# Altium schematic sheet Hammerhead - MAX11300 Breakout Connectors R1.1.SchDoc
size B; SheetNumber: 4
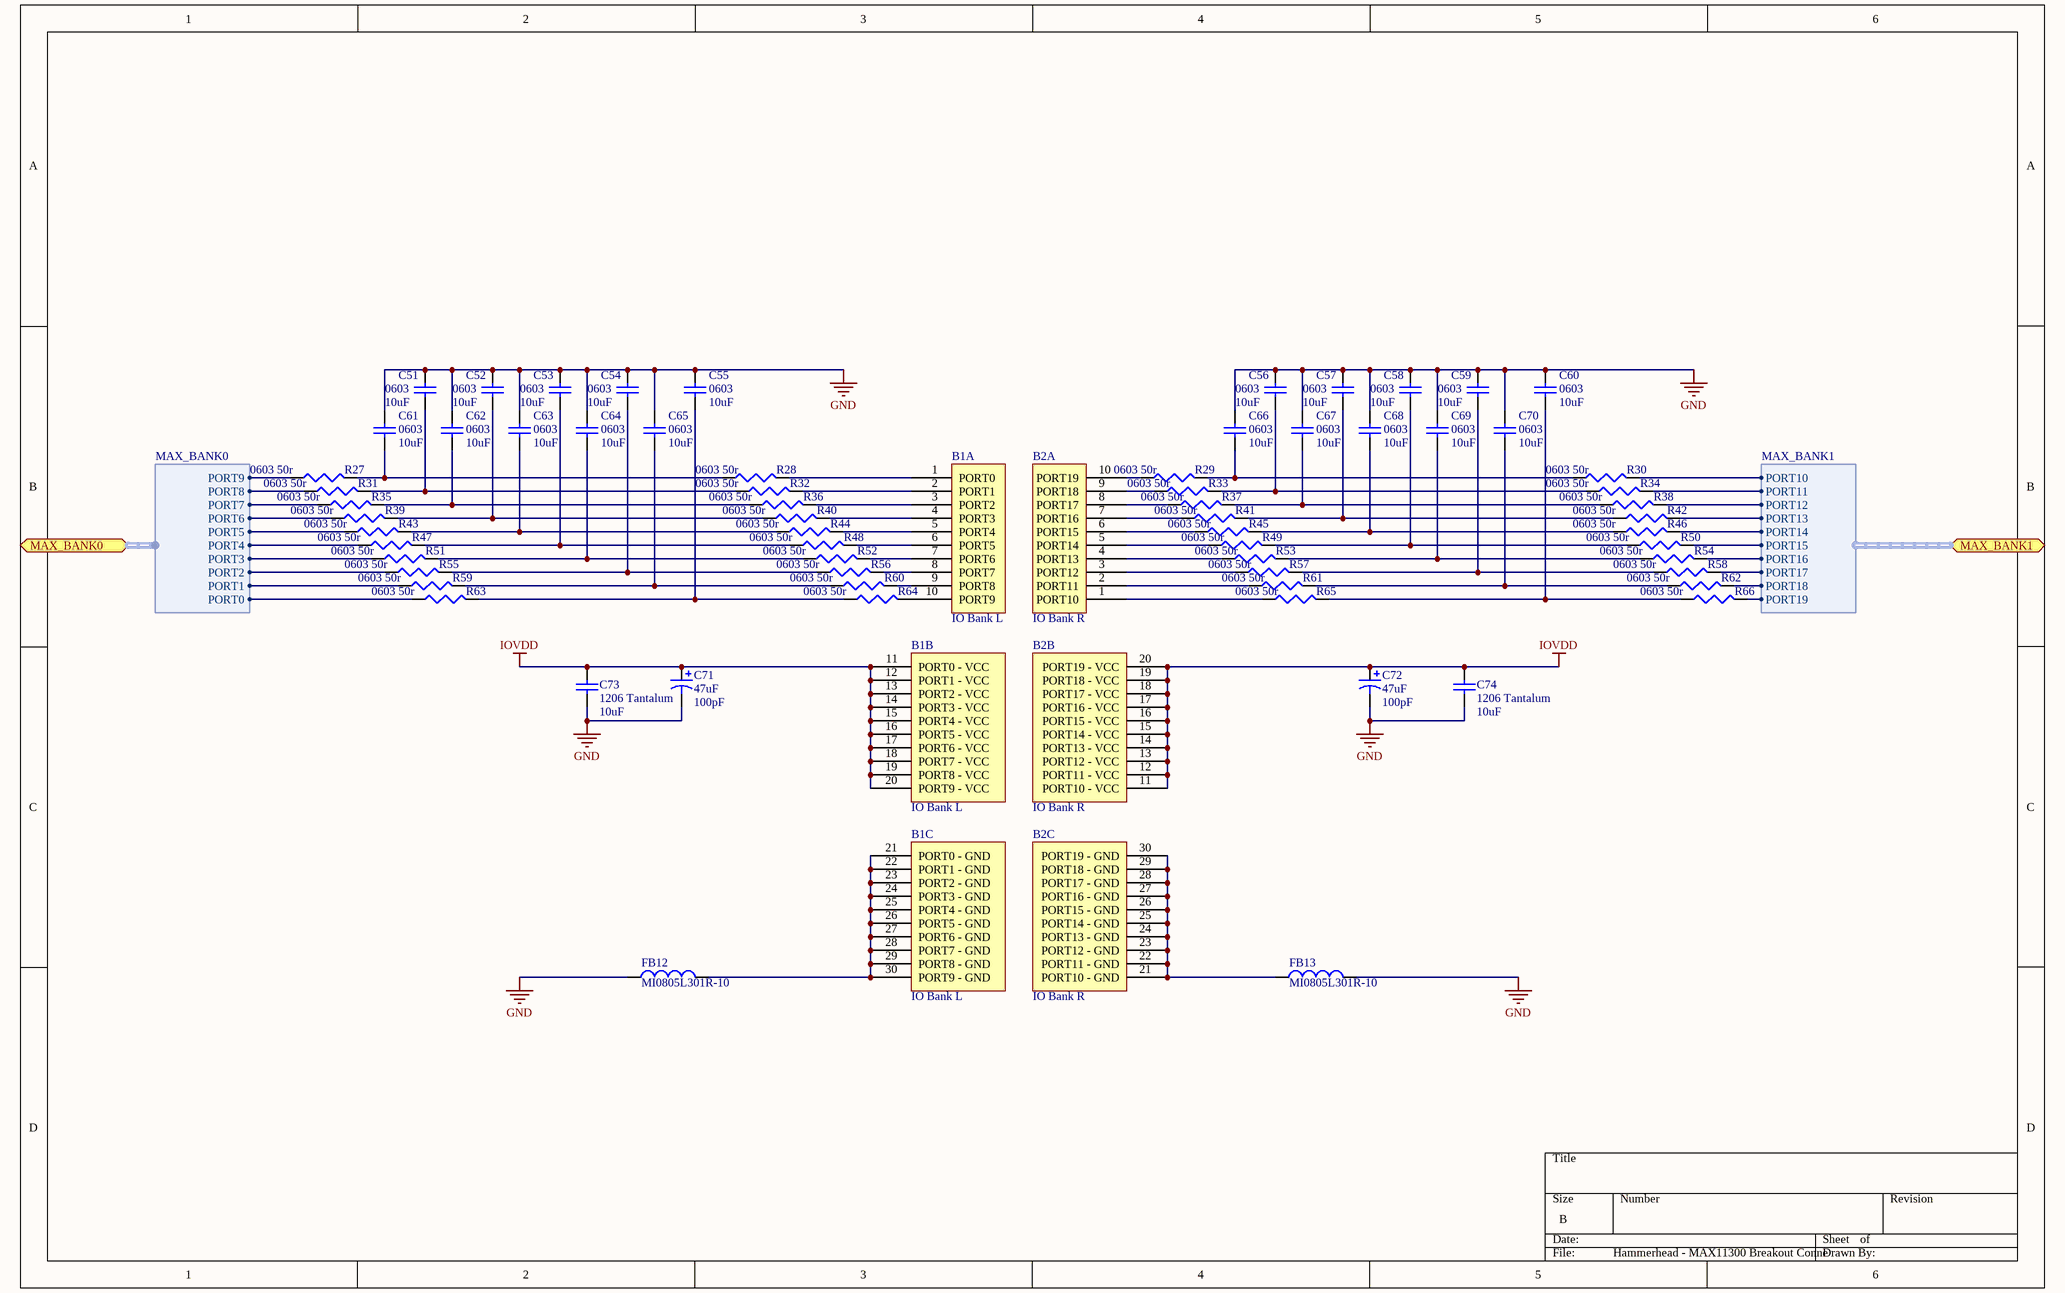
[diagram p0: Hammerhead - MAX11300 Breakout Connectors R1.1.SchDoc]

## Parts
B1  IO Bank L  [2.54mm 10X3 Header]  (parts A,B,C of 3)
B2  IO Bank R  [2.54mm 10X3 Header]  (parts A,B,C of 3)
C51  0603  value 10uF  [1608[0603]]
C52  0603  value 10uF  [1608[0603]]
C53  0603  value 10uF  [1608[0603]]
C54  0603  value 10uF  [1608[0603]]
C55  0603  value 10uF  [1608[0603]]
C56  0603  value 10uF  [1608[0603]]
C57  0603  value 10uF  [1608[0603]]
C58  0603  value 10uF  [1608[0603]]
C59  0603  value 10uF  [1608[0603]]
C60  0603  value 10uF  [1608[0603]]
C61  0603  value 10uF  [1608[0603]]
C62  0603  value 10uF  [1608[0603]]
C63  0603  value 10uF  [1608[0603]]
C64  0603  value 10uF  [1608[0603]]
C65  0603  value 10uF  [1608[0603]]
C66  0603  value 10uF  [1608[0603]]
C67  0603  value 10uF  [1608[0603]]
C68  0603  value 10uF  [1608[0603]]
C69  0603  value 10uF  [1608[0603]]
C70  0603  value 10uF  [1608[0603]]
C71  47uF  value 100pF  [Panasonic VS C]
C72  47uF  value 100pF  [Panasonic VS C]
C73  1206 Tantalum  value 10uF  [C1206]
C74  1206 Tantalum  value 10uF  [C1206]
FB12  MI0805L301R-10  [SM 0805 - gap trimmed]
FB13  MI0805L301R-10  [SM 0805 - gap trimmed]
R27  0603  value 50r  [J1-0603]
R28  0603  value 50r  [J1-0603]
R29  0603  value 50r  [J1-0603]
R30  0603  value 50r  [J1-0603]
R31  0603  value 50r  [J1-0603]
R32  0603  value 50r  [J1-0603]
R33  0603  value 50r  [J1-0603]
R34  0603  value 50r  [J1-0603]
R35  0603  value 50r  [J1-0603]
R36  0603  value 50r  [J1-0603]
R37  0603  value 50r  [J1-0603]
R38  0603  value 50r  [J1-0603]
R39  0603  value 50r  [J1-0603]
R40  0603  value 50r  [J1-0603]
R41  0603  value 50r  [J1-0603]
R42  0603  value 50r  [J1-0603]
R43  0603  value 50r  [J1-0603]
R44  0603  value 50r  [J1-0603]
R45  0603  value 50r  [J1-0603]
R46  0603  value 50r  [J1-0603]
R47  0603  value 50r  [J1-0603]
R48  0603  value 50r  [J1-0603]
R49  0603  value 50r  [J1-0603]
R50  0603  value 50r  [J1-0603]
R51  0603  value 50r  [J1-0603]
R52  0603  value 50r  [J1-0603]
R53  0603  value 50r  [J1-0603]
R54  0603  value 50r  [J1-0603]
R55  0603  value 50r  [J1-0603]
R56  0603  value 50r  [J1-0603]
R57  0603  value 50r  [J1-0603]
R58  0603  value 50r  [J1-0603]
R59  0603  value 50r  [J1-0603]
R60  0603  value 50r  [J1-0603]
R61  0603  value 50r  [J1-0603]
R62  0603  value 50r  [J1-0603]
R63  0603  value 50r  [J1-0603]
R64  0603  value 50r  [J1-0603]
R65  0603  value 50r  [J1-0603]
R66  0603  value 50r  [J1-0603]

## Ports
MAX_BANK0 (harness MAX_BANK0), MAX_BANK1 (harness MAX_BANK1)

## Harnesses
MAX_BANK1: PORT19, PORT18, PORT17, PORT16, PORT15, PORT14, PORT13, PORT12, PORT11, PORT10
MAX_BANK0: PORT0, PORT1, PORT2, PORT3, PORT4, PORT5, PORT6, PORT7, PORT8, PORT9

## Nets
GND: C51.2 C52.2 C53.2 C54.2 C55.2 C56.2 C57.2 C58.2 C59.2 C60.2 C61.2 C62.2 C63.2 C64.2 C65.2 C66.2 C67.2 C68.2 C69.2 C70.2 C71.2 C72.2 C73.1 C74.1 FB12.1 FB13.2
IOVDD: B1.11(PORT0_-_VCC) B1.12(PORT1_-_VCC) B1.13(PORT2_-_VCC) B1.14(PORT3_-_VCC) B1.15(PORT4_-_VCC) B1.16(PORT5_-_VCC) B1.17(PORT6_-_VCC) B1.18(PORT7_-_VCC) B1.19(PORT8_-_VCC) B1.20(PORT9_-_VCC) B2.11(PORT10_-_VCC) B2.12(PORT11_-_VCC) B2.13(PORT12_-_VCC) B2.14(PORT13_-_VCC) B2.15(PORT14_-_VCC) B2.16(PORT15_-_VCC) B2.17(PORT16_-_VCC) B2.18(PORT17_-_VCC) B2.19(PORT18_-_VCC) B2.20(PORT19_-_VCC) C71.1 C72.1 C73.2 C74.2
NetB1_1: B1.1(PORT0) R28.2
NetB1_2: B1.2(PORT1) R32.2
NetB1_3: B1.3(PORT2) R36.2
NetB1_4: B1.4(PORT3) R40.2
NetB1_5: B1.5(PORT4) R44.2
NetB1_6: B1.6(PORT5) R48.2
NetB1_7: B1.7(PORT6) R52.2
NetB1_8: B1.8(PORT7) R56.2
NetB1_9: B1.9(PORT8) R60.2
NetB1_10: B1.10(PORT9) R64.2
NetB1_21: B1.21(PORT0_-_GND) B1.22(PORT1_-_GND) B1.23(PORT2_-_GND) B1.24(PORT3_-_GND) B1.25(PORT4_-_GND) B1.26(PORT5_-_GND) B1.27(PORT6_-_GND) B1.28(PORT7_-_GND) B1.29(PORT8_-_GND) B1.30(PORT9_-_GND) FB12.2
NetB2_1: B2.1(PORT10) R65.1
NetB2_2: B2.2(PORT11) R61.1
NetB2_3: B2.3(PORT12) R57.1
NetB2_4: B2.4(PORT13) R53.1
NetB2_5: B2.5(PORT14) R49.1
NetB2_6: B2.6(PORT15) R45.1
NetB2_7: B2.7(PORT16) R41.1
NetB2_8: B2.8(PORT17) R37.1
NetB2_9: B2.9(PORT18) R33.1
NetB2_10: B2.10(PORT19) R29.1
NetB2_21: B2.21(PORT10_-_GND) B2.22(PORT11_-_GND) B2.23(PORT12_-_GND) B2.24(PORT13_-_GND) B2.25(PORT14_-_GND) B2.26(PORT15_-_GND) B2.27(PORT16_-_GND) B2.28(PORT17_-_GND) B2.29(PORT18_-_GND) B2.30(PORT19_-_GND) FB13.1
NetC51_1: C51.1 R31.2 R32.1
NetC52_1: C52.1 R39.2 R40.1
NetC53_1: C53.1 R47.2 R48.1
NetC54_1: C54.1 R55.2 R56.1
NetC55_1: C55.1 R63.2 R64.1
NetC56_1: C56.1 R33.2 R34.1
NetC57_1: C57.1 R41.2 R42.1
NetC58_1: C58.1 R49.2 R50.1
NetC59_1: C59.1 R57.2 R58.1
NetC60_1: C60.1 R65.2 R66.1
NetC61_1: C61.1 R27.2 R28.1
NetC62_1: C62.1 R35.2 R36.1
NetC63_1: C63.1 R43.2 R44.1
NetC64_1: C64.1 R51.2 R52.1
NetC65_1: C65.1 R59.2 R60.1
NetC66_1: C66.1 R29.2 R30.1
NetC67_1: C67.1 R37.2 R38.1
NetC68_1: C68.1 R45.2 R46.1
NetC69_1: C69.1 R53.2 R54.1
NetC70_1: C70.1 R61.2 R62.1
NetR27_1: R27.1 ; port MAX_BANK0.PORT9
NetR30_2: R30.2 ; port MAX_BANK1.PORT10
NetR31_1: R31.1 ; port MAX_BANK0.PORT8
NetR34_2: R34.2 ; port MAX_BANK1.PORT11
NetR35_1: R35.1 ; port MAX_BANK0.PORT7
NetR38_2: R38.2 ; port MAX_BANK1.PORT12
NetR39_1: R39.1 ; port MAX_BANK0.PORT6
NetR42_2: R42.2 ; port MAX_BANK1.PORT13
NetR43_1: R43.1 ; port MAX_BANK0.PORT5
NetR46_2: R46.2 ; port MAX_BANK1.PORT14
NetR47_1: R47.1 ; port MAX_BANK0.PORT4
NetR50_2: R50.2 ; port MAX_BANK1.PORT15
NetR51_1: R51.1 ; port MAX_BANK0.PORT3
NetR54_2: R54.2 ; port MAX_BANK1.PORT16
NetR55_1: R55.1 ; port MAX_BANK0.PORT2
NetR58_2: R58.2 ; port MAX_BANK1.PORT17
NetR59_1: R59.1 ; port MAX_BANK0.PORT1
NetR62_2: R62.2 ; port MAX_BANK1.PORT18
NetR63_1: R63.1 ; port MAX_BANK0.PORT0
NetR66_2: R66.2 ; port MAX_BANK1.PORT19

## Library data of the parts
C51-C70 C73 C74 = Cap Semi: Capacitor (Semiconductor SIM Model); Published: 8-Jun-2000; LatestRevisionDate: 29-May-2009; LatestRevisionNote: IPC-7351 Footprint Added.; PackageReference: C1206; Publisher: Altium Limited; PackageDescription: Chip Capacitor
C71 C72 = Cap Pol1: Polarized Capacitor (Radial); Published: 8-Jun-2000; LatestRevisionDate: 17-Jul-2002; LatestRevisionNote: Re-released for DXP Platform.; PackageReference: RB7.6-15; Publisher: Altium Limited; PackageDescription: Polarized Capacitor (Radial); 2 Leads
FB12 FB13 = Inductor: Code_IEC: 1005; Published: 8-Jun-2000; LatestRevisionDate: 17-Jul-2002; LatestRevisionNote: Re-released for DXP Platform.; PackageReference: 0402-A; Publisher: Altium Limited; Code_JEITA: 0402
R27-R66 = Res3: Resistor; Published: 8-Jun-2000; LatestRevisionDate: 29-May-2009; LatestRevisionNote: IPC-7351 Footprint Added.; PackageReference: J1-0603; Publisher: Altium Limited; PackageDescription: Chip Resistor